# Altium schematic sheet 核心板.SchDoc
size A3
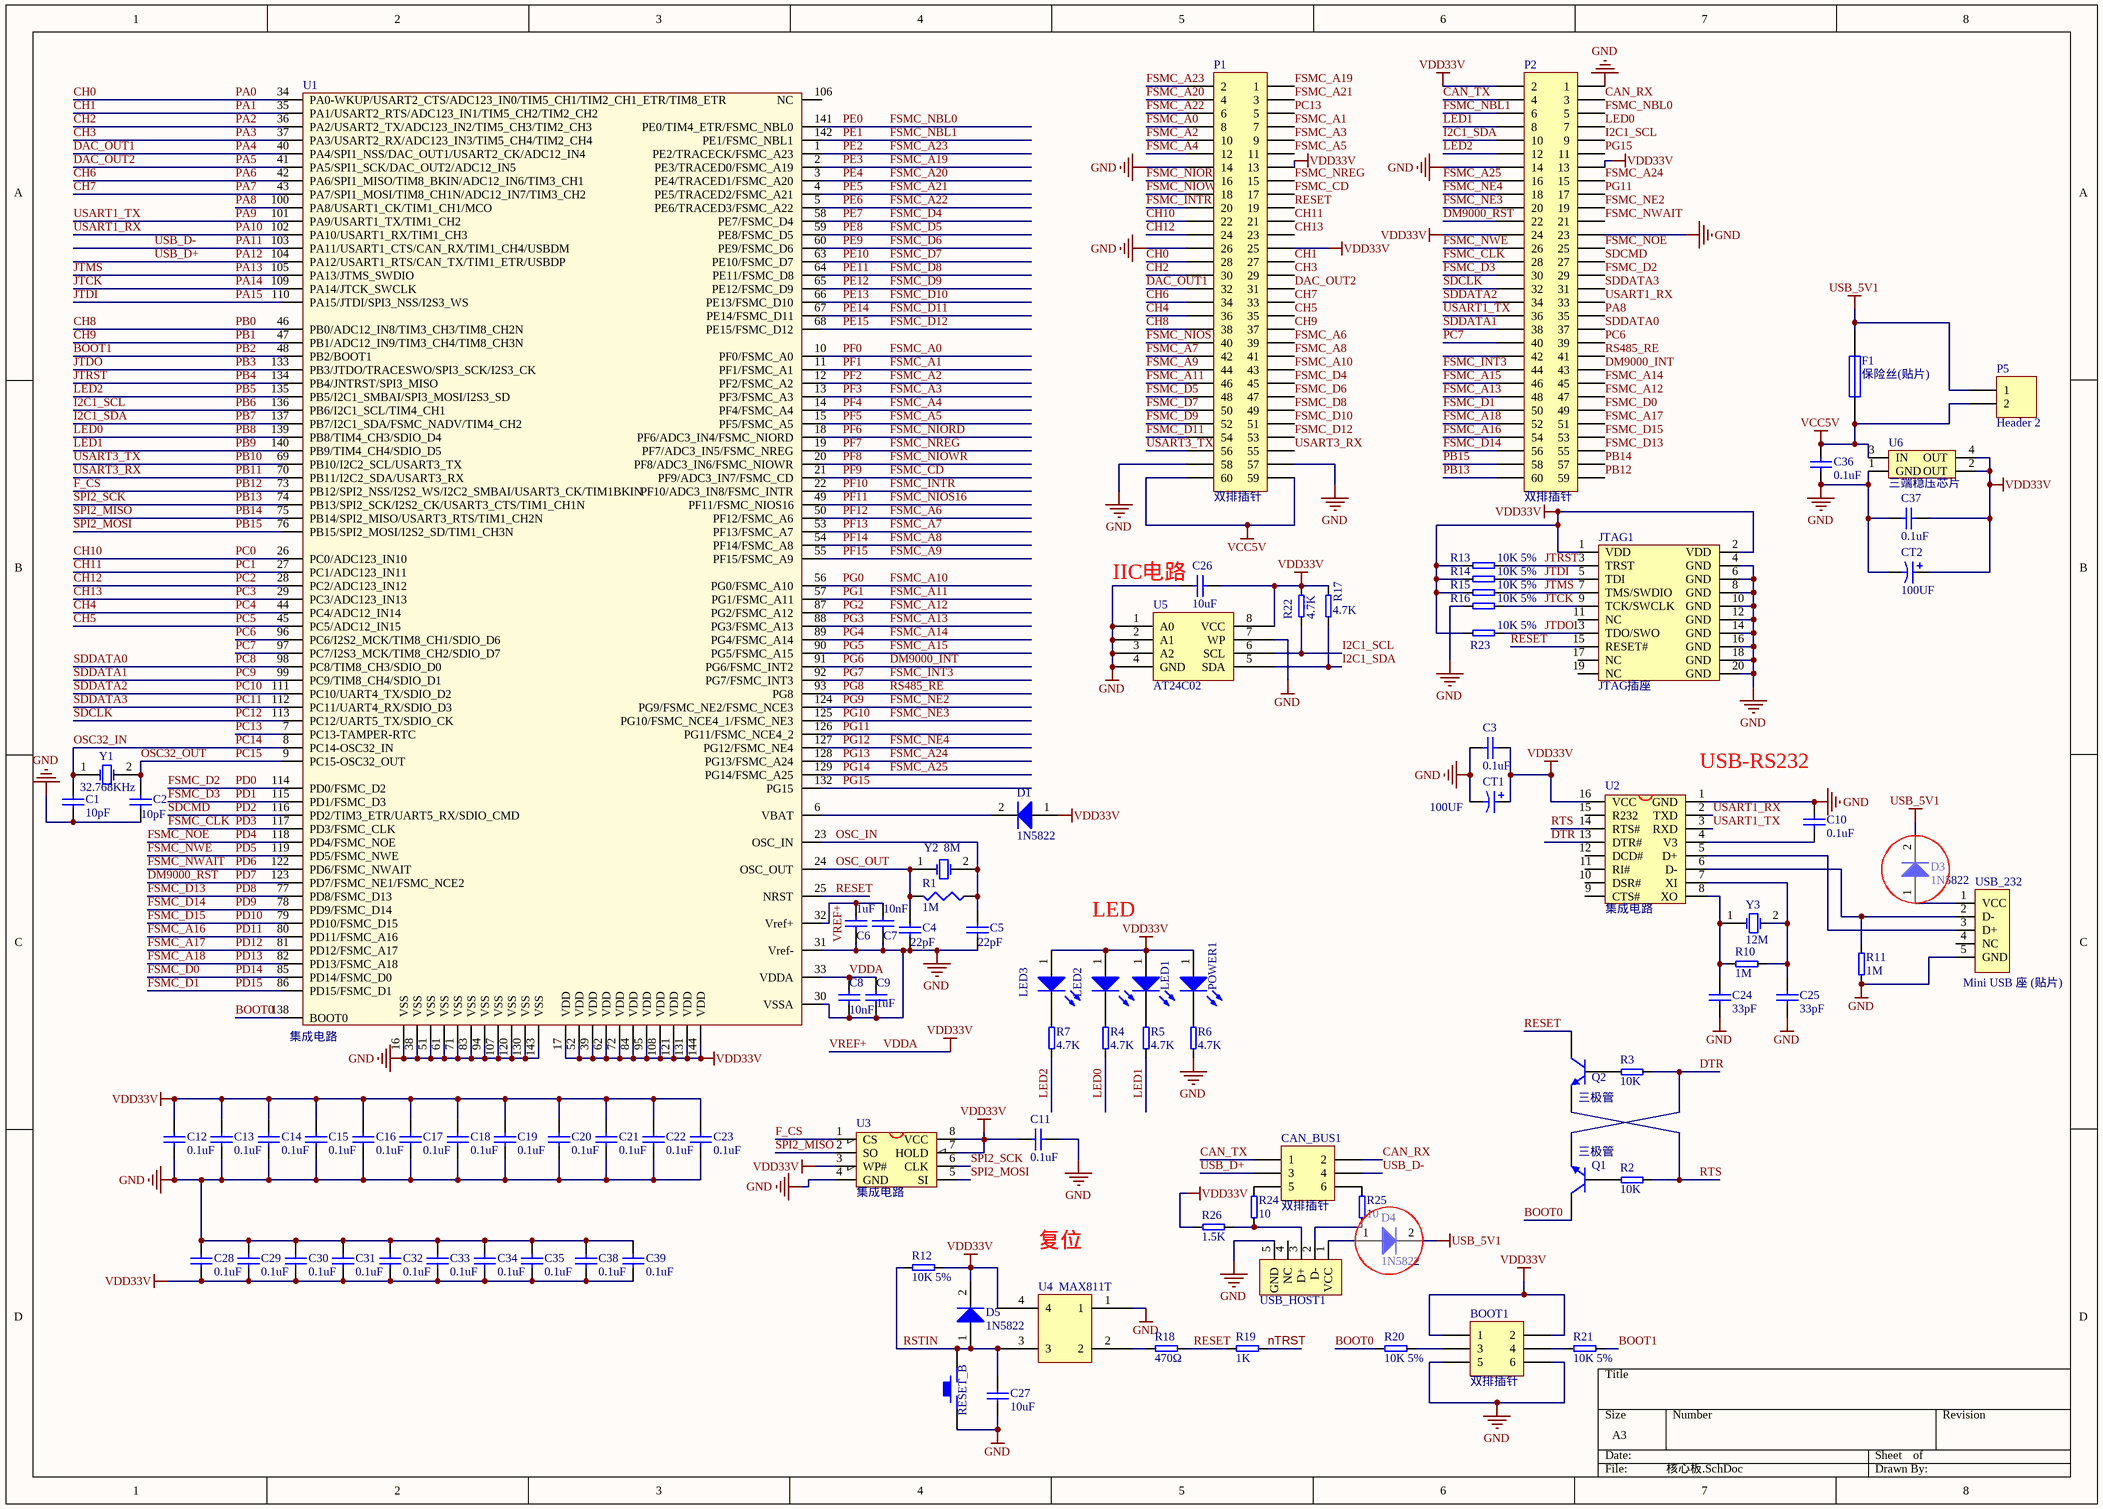
[diagram p0: 核心板.SchDoc]

## Parts
BOOT1  双排插针  [HDR2X3]
C1  value 10pF  [0603]  (hidden comment: 电容(贴片))
C2  value 10pF  [0603]  (hidden comment: 电容(贴片))
C3  value 0.1uF  [0603]  (hidden comment: 电容(贴片))
C4  value 22pF  [0603]  (hidden comment: 电容(贴片))
C5  value 22pF  [0603]  (hidden comment: 电容(贴片))
C6  value 1uF  [0603]  (hidden comment: 电容(贴片))
C7  value 10nF  [0603]  (hidden comment: 电容(贴片))
C8  value 10nF  [0603]  (hidden comment: 电容(贴片))
C9  value 1uF  [0603]  (hidden comment: 电容(贴片))
C10  value 0.1uF  [0603]  (hidden comment: 电容(贴片))
C11  value 0.1uF  [0603]  (hidden comment: 电容(贴片))
C12  value 0.1uF  [0603]  (hidden comment: 电容(贴片))
C13  value 0.1uF  [0603]  (hidden comment: 电容(贴片))
C14  value 0.1uF  [0603]  (hidden comment: 电容(贴片))
C15  value 0.1uF  [0603]  (hidden comment: 电容(贴片))
C16  value 0.1uF  [0603]  (hidden comment: 电容(贴片))
C17  value 0.1uF  [0603]  (hidden comment: 电容(贴片))
C18  value 0.1uF  [0603]  (hidden comment: 电容(贴片))
C19  value 0.1uF  [0603]  (hidden comment: 电容(贴片))
C20  value 0.1uF  [0603]  (hidden comment: 电容(贴片))
C21  value 0.1uF  [0603]  (hidden comment: 电容(贴片))
C22  value 0.1uF  [0603]  (hidden comment: 电容(贴片))
C23  value 0.1uF  [0603]  (hidden comment: 电容(贴片))
C24  value 33pF  [0603]  (hidden comment: 电容(贴片))
C25  value 33pF  [0603]  (hidden comment: 电容(贴片))
C26  value 10uF  [0603]  (hidden comment: 电容(贴片))
C27  value 10uF  [0603]  (hidden comment: 电容(贴片))
C28  value 0.1uF  [0603]  (hidden comment: 电容(贴片))
C29  value 0.1uF  [0603]  (hidden comment: 电容(贴片))
C30  value 0.1uF  [0603]  (hidden comment: 电容(贴片))
C31  value 0.1uF  [0603]  (hidden comment: 电容(贴片))
C32  value 0.1uF  [0603]  (hidden comment: 电容(贴片))
C33  value 0.1uF  [0603]  (hidden comment: 电容(贴片))
C34  value 0.1uF  [0603]  (hidden comment: 电容(贴片))
C35  value 0.1uF  [0603]  (hidden comment: 电容(贴片))
C36  value 0.1uF  [0603]  (hidden comment: 电容(贴片))
C37  value 0.1uF  [0603]  (hidden comment: 电容(贴片))
C38  value 0.1uF  [0603]  (hidden comment: 电容(贴片))
C39  value 0.1uF  [0603]  (hidden comment: 电容(贴片))
CAN_BUS1  双排插针  [HDR2X3]
CT1  value 100UF  [6032]  (hidden comment: 钽电容(贴片))
CT2  value 100UF  [6032]  (hidden comment: 钽电容(贴片))
D1  value 1N5822  [D1206]  (hidden comment: 二极管(贴片))
D3  value 1N5822  [D1206]  (hidden comment: 二极管(贴片))
D4  value 1N5822  [D1206]  (hidden comment: 二极管(贴片))
D5  value 1N5822  [D1206]  (hidden comment: 二极管(贴片))
F1  保险丝(贴片)  [0805]
JTAG1  JTAG插座  [JTAG_20]
LED1  二极管(贴片发光绿色)  [LED-0805]  (value not drawn)
LED2  二极管(贴片发光绿色)  [LED-0805]  (value not drawn)
LED3  二极管(贴片发光绿色)  [LED-0805]  (value not drawn)
P1  双排插针  [HDR2X30]
P2  双排插针  [HDR2X30]
P5  Header 2  [HDR1X2]
POWER1  二极管(贴片发光红色)  [LED-0805]  (value not drawn)
Q1  三极管  [sot-23]
Q2  三极管  [sot-23]
R1  value 1M  [0603]  (hidden comment: 电阻(贴片))
R2  value 10K  [0603]  (hidden comment: 电阻(贴片))
R3  value 10K  [0603]  (hidden comment: 电阻(贴片))
R4  value 4.7K  [0603]  (hidden comment: 电阻(贴片))
R5  value 4.7K  [0603]  (hidden comment: 电阻(贴片))
R6  value 4.7K  [0603]  (hidden comment: 电阻(贴片))
R7  value 4.7K  [0603]  (hidden comment: 电阻(贴片))
R10  value 1M  [0603]  (hidden comment: 电阻(贴片))
R11  value 1M  [0603]  (hidden comment: 电阻(贴片))
R12  value 10K 5%  [0603]  (hidden comment: 电阻(贴片))
R13  value 10K 5%  [0603]  (hidden comment: 电阻(贴片))
R14  value 10K 5%  [0603]  (hidden comment: 电阻(贴片))
R15  value 10K 5%  [0603]  (hidden comment: 电阻(贴片))
R16  value 10K 5%  [0603]  (hidden comment: 电阻(贴片))
R17  value 4.7K  [0603]  (hidden comment: 电阻(贴片))
R18  value 470Ω  [0603]  (hidden comment: 电阻(贴片))
R19  value 1K  [0603]  (hidden comment: 电阻(贴片))
R20  value 10K 5%  [0603]  (hidden comment: 电阻(贴片))
R21  value 10K 5%  [0603]  (hidden comment: 电阻(贴片))
R22  value 4.7K  [0603]  (hidden comment: 电阻(贴片))
R23  value 10K 5%  [0603]  (hidden comment: 电阻(贴片))
R24  value 10  [0603]  (hidden comment: 电阻(贴片))
R25  value 10  [0603]  (hidden comment: 电阻(贴片))
R26  value 1.5K  [0603]  (hidden comment: 电阻(贴片))
RESET_B  复位按键  [KEY_M]  (value not drawn)
U1  集成电路  [LQFP144]
U2  集成电路  [SOP16M]
U3  集成电路  [SOIC-8]
U4  value MAX811T  [MAX811T]  (hidden comment: 集成电路贴片)
U5  value AT24C02  [SOP8]  (hidden comment: 集成电路贴片)
U6  三端稳压芯片  [AMS1117]
USB_232  Mini USB 座 (贴片)  [USB/SM0.8-6H5]
USB_HOST1  Mini USB 座 (贴片)  [USB/SM0.8-6H5]  (value not drawn)
Y1  value 32.768KHz  [32.768khz]  (hidden comment: 晶体(直插))
Y2  value 8M  [CRYSTAL_SMD]  (hidden comment: 晶体(贴片))
Y3  value 12M  [CRYSTAL_SMD]  (hidden comment: 晶体(贴片))

## Nets
GND: BOOT1.5 BOOT1.6 C1.2 C2.2 C3.1 C4.2 C5.2 C6.1 C7.1 C8.2 C9.2 C10.2 C11.2 C12.1 C13.1 C14.1 C15.1 C16.1 C17.1 C18.1 C19.1 C20.1 C21.1 C22.1 C23.1 C24.1 C25.1 C26.1 C27.2 C28.2 C29.2 C30.2 C31.2 C32.2 C33.2 C34.2 C35.2 C36.1 C37.2 C38.2 C39.2 CT1.2 CT2.2 JTAG1.4(GND) JTAG1.6(GND) JTAG1.8(GND) JTAG1.10(GND) JTAG1.12(GND) JTAG1.14(GND) JTAG1.16(GND) JTAG1.18(GND) JTAG1.20(GND) P1.14 P1.26 P1.57 P1.58 P2.1 P2.14 P2.23 R6.1 R11.2 R16.1 RESET_B.1 U1.16(VSS) U1.30(VSSA) U1.31(Vref-) U1.38(VSS) U1.51(VSS) U1.61(VSS) U1.71(VSS) U1.83(VSS) U1.94(VSS) U1.107(VSS) U1.120(VSS) U1.130(VSS) U1.143(VSS) U2.1(GND) U3.4(GND) U4.1 U5.1(A0) U5.2(A1) U5.3(A2) U5.4(GND) U5.7(WP) U6.1(GND) USB_232.5(GND) USB_HOST1.5(GND)
USB_5V1: D3.2(K) D4.2(K) F1.2 P5.1
VCC5V: C36.2 F1.1 P1.59 P1.60 P5.2 U6.3(IN)
VDDA: BOOT1.1 BOOT1.2 C3.2 C6.2 C7.2 C8.1 C9.1 C11.1 C12.2 C13.2 C14.2 C15.2 C16.2 C17.2 C18.2 C19.2 C20.2 C21.2 C22.2 C23.2 C26.2 C28.1 C29.1 C30.1 C31.1 C32.1 C33.1 C34.1 C35.1 C37.1 C38.1 C39.1 CT1.1 CT2.1 D1.1(A) D5.2(K) JTAG1.1(VDD) JTAG1.2(VDD) LED1.1(A) LED2.1(A) LED3.1(A) P1.13 P1.25 P2.2 P2.13 P2.24 POWER1.1(A) R12.1 R13.1 R14.1 R15.1 R17.2 R22.2 R23.1 R26.2 U1.17(VDD) U1.32(Vref+) U1.33(VDDA) U1.39(VDD) U1.52(VDD) U1.62(VDD) U1.72(VDD) U1.84(VDD) U1.95(VDD) U1.108(VDD) U1.121(VDD) U1.131(VDD) U1.144(VDD) U2.16(VCC) U3.3(WP#) U3.7(HOLD) U3.8(VCC) U4.4 U5.8(VCC) U6.2(OUT) U6.4(OUT)  [also labelled VDD33V, VREF+]
BOOT0: Q1.3(C) R20.2 U1.138(BOOT0)
BOOT1: R21.1 U1.48(PB2/BOOT1)  [also labelled PB2]
CAN_RX: CAN_BUS1.2 P2.3
CAN_TX: CAN_BUS1.1 P2.4
CH0: P1.28 U1.34(PA0-WKUP/USART2_CTS/ADC123_IN0/TIM5_CH1/TIM2_CH1_ETR/TIM8_ETR)  [also labelled PA0]
CH1: P1.27 U1.35(PA1/USART2_RTS/ADC123_IN1/TIM5_CH2/TIM2_CH2)  [also labelled PA1]
CH2: P1.30 U1.36(PA2/USART2_TX/ADC123_IN2/TIM5_CH3/TIM2_CH3)  [also labelled PA2]
CH3: P1.29 U1.37(PA3/USART2_RX/ADC123_IN3/TIM5_CH4/TIM2_CH4)  [also labelled PA3]
CH4: P1.36 U1.44(PC4/ADC12_IN14)  [also labelled PC4]
CH5: P1.35 U1.45(PC5/ADC12_IN15)  [also labelled PC5]
CH6: P1.34 U1.42(PA6/SPI1_MISO/TIM8_BKIN/ADC12_IN6/TIM3_CH1)  [also labelled PA6]
CH7: P1.33 U1.43(PA7/SPI1_MOSI/TIM8_CH1N/ADC12_IN7/TIM3_CH2)  [also labelled PA7]
CH8: P1.38 U1.46(PB0/ADC12_IN8/TIM3_CH3/TIM8_CH2N)  [also labelled PB0]
CH9: P1.37 U1.47(PB1/ADC12_IN9/TIM3_CH4/TIM8_CH3N)  [also labelled PB1]
CH10: P1.22 U1.26(PC0/ADC123_IN10)  [also labelled PC0]
CH11: P1.21 U1.27(PC1/ADC123_IN11)  [also labelled PC1]
CH12: P1.24 U1.28(PC2/ADC123_IN12)  [also labelled PC2]
CH13: P1.23 U1.29(PC3/ADC123_IN13)  [also labelled PC3]
DAC_OUT1: P1.32 U1.40(PA4/SPI1_NSS/DAC_OUT1/USART2_CK/ADC12_IN4)  [also labelled PA4]
DAC_OUT2: P1.31 U1.41(PA5/SPI1_SCK/DAC_OUT2/ADC12_IN5)  [also labelled PA5]
DM9000_INT: P2.43 U1.91(PG6/FSMC_INT2)  [also labelled PG6]
DM9000_RST: P2.22 U1.123(PD7/FSMC_NE1/FSMC_NCE2)  [also labelled PD7]
DTR: Q1.1(E) R3.1 U2.13(DTR#)
F_CS: P2.59 U1.73(PB12/SPI2_NSS/I2S2_WS/I2C2_SMBAI/USART3_CK/TIM1BKIN) U3.1(CS)  [also labelled PB12]
FSMC_A0: P1.8 U1.10(PF0/FSMC_A0)  [also labelled PF0]
FSMC_A1: P1.7 U1.11(PF1/FSMC_A1)  [also labelled PF1]
FSMC_A2: P1.10 U1.12(PF2/FSMC_A2)  [also labelled PF2]
FSMC_A3: P1.9 U1.13(PF3/FSMC_A3)  [also labelled PF3]
FSMC_A4: P1.12 U1.14(PF4/FSMC_A4)  [also labelled PF4]
FSMC_A5: P1.11 U1.15(PF5/FSMC_A5)  [also labelled PF5]
FSMC_A6: P1.39 U1.50(PF12/FSMC_A6)  [also labelled PF12]
FSMC_A7: P1.42 U1.53(PF13/FSMC_A7)  [also labelled PF13]
FSMC_A8: P1.41 U1.54(PF14/FSMC_A8)  [also labelled PF14]
FSMC_A9: P1.44 U1.55(PF15/FSMC_A9)  [also labelled PF15]
FSMC_A10: P1.43 U1.56(PG0/FSMC_A10)  [also labelled PG0]
FSMC_A11: P1.46 U1.57(PG1/FSMC_A11)  [also labelled PG1]
FSMC_A12: P2.47 U1.87(PG2/FSMC_A12)  [also labelled PG2]
FSMC_A13: P2.48 U1.88(PG3/FSMC_A13)  [also labelled PG3]
FSMC_A14: P2.45 U1.89(PG4/FSMC_A14)  [also labelled PG4]
FSMC_A15: P2.46 U1.90(PG5/FSMC_A15)  [also labelled PG5]
FSMC_A16: P2.54 U1.80(PD11/FSMC_A16)  [also labelled PD11]
FSMC_A17: P2.51 U1.81(PD12/FSMC_A17)  [also labelled PD12]
FSMC_A18: P2.52 U1.82(PD13/FSMC_A18)  [also labelled PD13]
FSMC_A19: P1.1 U1.2(PE3/TRACED0/FSMC_A19)  [also labelled PE3]
FSMC_A20: P1.4 U1.3(PE4/TRACED1/FSMC_A20)  [also labelled PE4]
FSMC_A21: P1.3 U1.4(PE5/TRACED2/FSMC_A21)  [also labelled PE5]
FSMC_A22: P1.6 U1.5(PE6/TRACED3/FSMC_A22)  [also labelled PE6]
FSMC_A23: P1.2 U1.1(PE2/TRACECK/FSMC_A23)  [also labelled PE2]
FSMC_A24: P2.15 U1.128(PG13/FSMC_A24)  [also labelled PG13]
FSMC_A25: P2.16 U1.129(PG14/FSMC_A25)  [also labelled PG14]
FSMC_CD: P1.17 U1.21(PF9/ADC3_IN7/FSMC_CD)  [also labelled PF9]
FSMC_CLK: P2.28 U1.117(PD3/FSMC_CLK)  [also labelled PD3]
FSMC_D0: P2.49 U1.85(PD14/FSMC_D0)  [also labelled PD14]
FSMC_D1: P2.50 U1.86(PD15/FSMC_D1)  [also labelled PD15]
FSMC_D2: P2.29 U1.114(PD0/FSMC_D2)  [also labelled PD0]
FSMC_D3: P2.30 U1.115(PD1/FSMC_D3)  [also labelled PD1]
FSMC_D4: P1.45 U1.58(PE7/FSMC_D4)  [also labelled PE7]
FSMC_D5: P1.48 U1.59(PE8/FSMC_D5)  [also labelled PE8]
FSMC_D6: P1.47 U1.60(PE9/FSMC_D6)  [also labelled PE9]
FSMC_D7: P1.50 U1.63(PE10/FSMC_D7)  [also labelled PE10]
FSMC_D8: P1.49 U1.64(PE11/FSMC_D8)  [also labelled PE11]
FSMC_D9: P1.52 U1.65(PE12/FSMC_D9)  [also labelled PE12]
FSMC_D10: P1.51 U1.66(PE13/FSMC_D10)  [also labelled PE13]
FSMC_D11: P1.54 U1.67(PE14/FSMC_D11)  [also labelled PE14]
FSMC_D12: P1.53 U1.68(PE15/FSMC_D12)  [also labelled PE15]
FSMC_D13: P2.55 U1.77(PD8/FSMC_D13)  [also labelled PD8]
FSMC_D14: P2.56 U1.78(PD9/FSMC_D14)  [also labelled PD9]
FSMC_D15: P2.53 U1.79(PD10/FSMC_D15)  [also labelled PD10]
FSMC_INT3: P2.44 U1.92(PG7/FSMC_INT3)  [also labelled PG7]
FSMC_INTR: P1.20 U1.22(PF10/ADC3_IN8/FSMC_INTR)  [also labelled PF10]
FSMC_NBL0: P2.5 U1.141(PE0/TIM4_ETR/FSMC_NBL0)  [also labelled PE0]
FSMC_NBL1: P2.6 U1.142(PE1/FSMC_NBL1)  [also labelled PE1]
FSMC_NE2: P2.19 U1.124(PG9/FSMC_NE2/FSMC_NCE3)  [also labelled PG9]
FSMC_NE3: P2.20 U1.125(PG10/FSMC_NCE4_1/FSMC_NE3)  [also labelled PG10]
FSMC_NE4: P2.18 U1.127(PG12/FSMC_NE4)  [also labelled PG12]
FSMC_NIORD: P1.16 U1.18(PF6/ADC3_IN4/FSMC_NIORD)  [also labelled PF6]
FSMC_NIOS16: P1.40 U1.49(PF11/FSMC_NIOS16)  [also labelled PF11]
FSMC_NIOWR: P1.18 U1.20(PF8/ADC3_IN6/FSMC_NIOWR)  [also labelled PF8]
FSMC_NOE: P2.25 U1.118(PD4/FSMC_NOE)  [also labelled PD4]
FSMC_NREG: P1.15 U1.19(PF7/ADC3_IN5/FSMC_NREG)  [also labelled PF7]
FSMC_NWAIT: P2.21 U1.122(PD6/FSMC_NWAIT)  [also labelled PD6]
FSMC_NWE: P2.26 U1.119(PD5/FSMC_NWE)  [also labelled PD5]
I2C1_SCL: P2.9 R22.1 U1.136(PB6/I2C1_SCL/TIM4_CH1) U5.6(SCL)  [also labelled PB6]
I2C1_SDA: P2.10 R17.1 U1.137(PB7/I2C1_SDA/FSMC_NADV/TIM4_CH2) U5.5(SDA)  [also labelled PB7]
JTCK: JTAG1.9(TCK/SWCLK) R16.2 U1.109(PA14/JTCK_SWCLK)  [also labelled PA14]
JTDI: JTAG1.5(TDI) R14.2 U1.110(PA15/JTDI/SPI3_NSS/I2S3_WS)  [also labelled PA15]
JTDO: JTAG1.13(TDO/SWO) R23.2 U1.133(PB3/JTDO/TRACESWO/SPI3_SCK/I2S3_CK)  [also labelled PB3]
JTMS: JTAG1.7(TMS/SWDIO) R15.2 U1.105(PA13/JTMS_SWDIO)  [also labelled PA13]
JTRST: JTAG1.3(TRST) R13.2 U1.134(PB4/JNTRST/SPI3_MISO)  [also labelled PB4]
LED0: P2.7 R4.1 U1.139(PB8/TIM4_CH3/SDIO_D4)  [also labelled PB8]
LED1: P2.8 R5.1 U1.140(PB9/TIM4_CH4/SDIO_D5)  [also labelled PB9]
LED2: P2.12 R7.1 U1.135(PB5/I2C1_SMBAI/SPI3_MOSI/I2S3_SD)  [also labelled PB5]
nTRST: R19.2
OSC32_IN: C1.1 U1.8(PC14-OSC32_IN) Y1.1(OSC1)  [also labelled PC14]
OSC32_OUT: C2.1 U1.9(PC15-OSC32_OUT) Y1.2(OSC2)  [also labelled PC15]
OSC_IN: C5.1 R1.1 U1.23(OSC_IN) Y2.2(OSC2)
OSC_OUT: C4.1 R1.2 U1.24(OSC_OUT) Y2.1(OSC1)
PA8: P2.35 U1.100(PA8/USART1_CK/TIM1_CH1/MCO)
PA9: P2.36 U1.101(PA9/USART1_TX/TIM1_CH2) U2.3(RXD)  [also labelled USART1_TX]
PA10: P2.33 U1.102(PA10/USART1_RX/TIM1_CH3) U2.2(TXD)  [also labelled USART1_RX]
PA11: CAN_BUS1.4 U1.103(PA11/USART1_CTS/CAN_RX/TIM1_CH4/USBDM)  [also labelled USB_D-]
PA12: CAN_BUS1.3 U1.104(PA12/USART1_RTS/CAN_TX/TIM1_ETR/USBDP)  [also labelled USB_D+]
PB10: P1.56 U1.69(PB10/I2C2_SCL/USART3_TX)  [also labelled USART3_TX]
PB11: P1.55 U1.70(PB11/I2C2_SDA/USART3_RX)  [also labelled USART3_RX]
PB13: P2.60 U1.74(PB13/SPI2_SCK/I2S2_CK/USART3_CTS/TIM1_CH1N) U3.6(CLK)  [also labelled SPI2_SCK]
PB14: P2.57 U1.75(PB14/SPI2_MISO/USART3_RTS/TIM1_CH2N) U3.2(SO)  [also labelled SPI2_MISO]
PB15: P2.58 U1.76(PB15/SPI2_MOSI/I2S2_SD/TIM1_CH3N) U3.5(SI)  [also labelled SPI2_MOSI]
PC6: P2.39 U1.96(PC6/I2S2_MCK/TIM8_CH1/SDIO_D6)
PC7: P2.40 U1.97(PC7/I2S3_MCK/TIM8_CH2/SDIO_D7)
PC8: P2.37 U1.98(PC8/TIM8_CH3/SDIO_D0)  [also labelled SDDATA0]
PC9: P2.38 U1.99(PC9/TIM8_CH4/SDIO_D1)  [also labelled SDDATA1]
PC10: P2.34 U1.111(PC10/UART4_TX/SDIO_D2)  [also labelled SDDATA2]
PC11: P2.31 U1.112(PC11/UART4_RX/SDIO_D3)  [also labelled SDDATA3]
PC12: P2.32 U1.113(PC12/UART5_TX/SDIO_CK)  [also labelled SDCLK]
PC13: P1.5 U1.7(PC13-TAMPER-RTC)
PD2: P2.27 U1.116(PD2/TIM3_ETR/UART5_RX/SDIO_CMD)  [also labelled SDCMD]
PG8: P2.41 U1.93(PG8)  [also labelled RS485_RE]
PG11: P2.17 U1.126(PG11/FSMC_NCE4_2)
PG15: P2.11 U1.132(PG15)
RESET: JTAG1.15(RESET#) P1.19 Q2.3(C) R18.1 R19.1 U1.25(NRST)
RSTIN: C27.1 D5.1(A) R12.2 RESET_B.2 U4.3
RTS: Q2.1(E) R2.1 U2.14(RTS#)
NetBOOT1_3: BOOT1.3 R20.1
NetBOOT1_4: BOOT1.4 R21.2
NetC10_1: C10.1 U2.4(V3)
NetC24_2: C24.2 R10.2 U2.8(XO) Y3.1(OSC1)
NetC25_2: C25.2 R10.1 U2.7(XI) Y3.2(OSC2)
NetCAN_BUS1_5: CAN_BUS1.5 R24.2
NetCAN_BUS1_6: CAN_BUS1.6 R25.2
NetD1_2: D1.2(K) U1.6(VBAT)
NetD3_1: D3.1(A) USB_232.1(VCC)
NetD4_1: D4.1(A) USB_HOST1.1(VCC)
NetLED1_2: LED1.2(K) R5.2
NetLED2_2: LED2.2(K) R4.2
NetLED3_2: LED3.2(K) R7.2
NetPOWER1_2: POWER1.2(K) R6.2
NetQ1_2: Q1.2(B) R2.2
NetQ2_2: Q2.2(B) R3.2
NetR11_1: R11.1 U2.6(D-) USB_232.2(D-)
NetR18_2: R18.2 U4.2
NetR24_1: R24.1 R26.1 USB_HOST1.3(D+)
NetR25_1: R25.1 USB_HOST1.2(D-)
NetU2_5: U2.5(D+) USB_232.3(D+)

Not connected (* = marked no-connect by the designer): JTAG1 11(NC) 17(NC) 19(NC); P2 42; U1 106(NC); U2 9(CTS#) 10(DSR#) 11(RI#) 12(DCD#) 15(R232); USB_232 4(NC); USB_HOST1 4(NC)

## Notes on the sheet
- IIC电路
- (near U2) USB-RS232
- LED
- 复位

## Library data of the parts
BOOT1 = Header 3X2: 2x3 脚间距2.54; LatestRevisionDate: 17-Jul-2002; LatestRevisionNote: Re-released for DXP Platform.; Publisher: Altium Limited
C1 C2 = Cap: CAP 10PF 50V CERAMIC 0603 SMD; Published: 8-Jun-2000; LatestRevisionDate: 17-Jul-2002; LatestRevisionNote: Re-released for DXP Platform.; PackageReference: RAD-0.3; Publisher: Altium Limited
C3 C10-C23 C28-C39 = CAP_0.1uF X7R 0603: 0603X7R104J160NT(0.1uF); ERP: 1508001607
C4 C5 = Cap: CAP 22PF 50V CERAMIC 0603 SMD; Published: 8-Jun-2000; LatestRevisionDate: 17-Jul-2002; LatestRevisionNote: Re-released for DXP Platform.; PackageReference: RAD-0.3; Publisher: Altium Limited
C6 C9 = Cap: CAP 1uf 16V CERAMIC X5R 0603; Published: 8-Jun-2000; LatestRevisionDate: 17-Jul-2002; LatestRevisionNote: Re-released for DXP Platform.; PackageReference: RAD-0.3; Publisher: Altium Limited
C7 C8 = Cap: CAP 10nf 16V CERAMIC X5R 0603; Published: 8-Jun-2000; LatestRevisionDate: 17-Jul-2002; LatestRevisionNote: Re-released for DXP Platform.; PackageReference: RAD-0.3; Publisher: Altium Limited
C24 C25 = CAP_33pF COG 0603: 0603COG330J500NT(33pF); ERP: 1508001604
C26 C27 = CAP_10uF/10V Z5U 0603: 0603Z5U106J100NT(10uF/10V); ERP: 1508001601
CAN_BUS1 = Header 3X2: 2x3 Pin 脚间距2.54mm; LatestRevisionDate: 17-Jul-2002; LatestRevisionNote: Re-released for DXP Platform.; Publisher: Altium Limited
CT1 CT2 = CAP TAN 100uF/10V/6032: CAP TANTALUM 100UF 16V 20% SMD; ERP: 1508009008
D1 D3-D5 = DIODE 1N4148/1206: 1N5822/1206; ERP: 1508036001
F1 = Fuse 1: 0.5A 0805; Published: 8-Jun-2000; LatestRevisionDate: 17-Jul-2002; LatestRevisionNote: Re-released for DXP Platform.; PackageReference: PIN-W2/E2.8; Publisher: Altium Limited
JTAG1 = JTAG: 20P 黑色 带缺口
LED1-LED3 = LED_GREEN 0805: 17-215SYGC-S530-E2-TR8; ERP: 1508038003; value: GREEN 0805
P1 P2 = Header 30X2: 双排 30*2P 脚间距 2.54mm; LatestRevisionDate: 17-Jul-2002; LatestRevisionNote: Re-released for DXP Platform.; Publisher: Altium Limited
P5 = Header 2: Header, 2-Pin; LatestRevisionDate: 17-Jul-2002; LatestRevisionNote: Re-released for DXP Platform.; Publisher: Altium Limited
POWER1 = LED_GREEN 0805: 17-215-SURC-S530-A3-TR8; ERP: 1508038003; value: RED 0805
Q1 Q2 = 2N3904: S8050 NPN General Purpose Amplifier; Published: 8-Jun-2000; LatestRevisionDate: 15-Jan-2003; LatestRevisionNote: PCB Footprint 'BCY-W3/D4.7' replaced; DatasheetDocument: 1997; PackageDocument: Sep-1998; PackageReference: TO-92A; Publisher: Altium Limited; Code_JEDEC: TO-92A; ComponentLink1Description: Manufacturer Link; ComponentLink1URL: http://www.fairchildsemi.com/; ComponentLink2Description: Datasheet; ComponentLink2URL: http://www.fairchildsemi.com/ds/2N%2F2N3904.pdf
R1 = Res3: RS-03K-105±5%(1MΩ); Published: 8-Jun-2000; LatestRevisionDate: 29-May-2009; LatestRevisionNote: IPC-7351 Footprint Added.; PackageReference: J1-0603; Publisher: Altium Limited; PackageDescription: Chip Resistor
R2 R10 R11 = RES_1MΩ 5% 0603: RS-03K-105±5%(1MΩ); ERP: 1508022039
R3 = RES_1MΩ 5% 0603: RS-03K-102±5%(1K); ERP: 1508022039
R4-R7 = RES_1K  5% 0603: RS-03K-472±5%(4.7K); ERP: 1508022715
R12-R16 R20 R21 R23 = RES_10K 5% 0603: RS-03K-103±5%(10KΩ); ERP: 1508022701
R17 R22 = RES_1.5K  5% 0603: RS-03K-152±5%(1.5KΩ); ERP: 1508022704
R18 = RES_470 5% 0603: RS-03K-471±5%(470Ω); ERP: 1508022707
R19 = RES_1K  5% 0603: RS-03K-102±5%(1K); ERP: 1508022715
R24 R25 = RES_1K  5% 0603: RS-03K-100±5%(10); ERP: 1508022715
R26 = RES_1K  5% 0603: RS-03K-152±5%(1.5K); ERP: 1508022715
RESET_B = KEY_M: 6*6*5 黑色 直插
U1 = STM32F103ZET6
U2 = CH340G
U3 = W25X16: W25Q128
U4 = Power MAX811T: MAX811T/SOT143  电源管理芯片; ERP: 1508056010
U5 = AT24C02A: AT24C02/SOP08; ERP: 1508056016
U6 = AMS1117: AMS1117-3.3
USB_232 USB_HOST1 = USB5: Mini USB
Y1 = CRYSTAL 12M HC-49SMD: HC-49DIP/32.768KHz; ERP: 1508043206; Published: 8-Jun-2000; Publisher: Altium Limited; Revision: July-2002: Re-released for DXP Platform.
Y2 = CRYSTAL 12M HC-49SMD: HC-49SMD/8.000MHz; ERP: 1508043206; Published: 8-Jun-2000; Publisher: Altium Limited; Revision: July-2002: Re-released for DXP Platform.
Y3 = CRYSTAL 12M HC-49SMD: HC-49SMD/12.000MHz; ERP: 1508043206; Published: 8-Jun-2000; Publisher: Altium Limited; Revision: July-2002: Re-released for DXP Platform.